# EAGLE schematic Bathroom_Board (EAGLE 6.5.0)
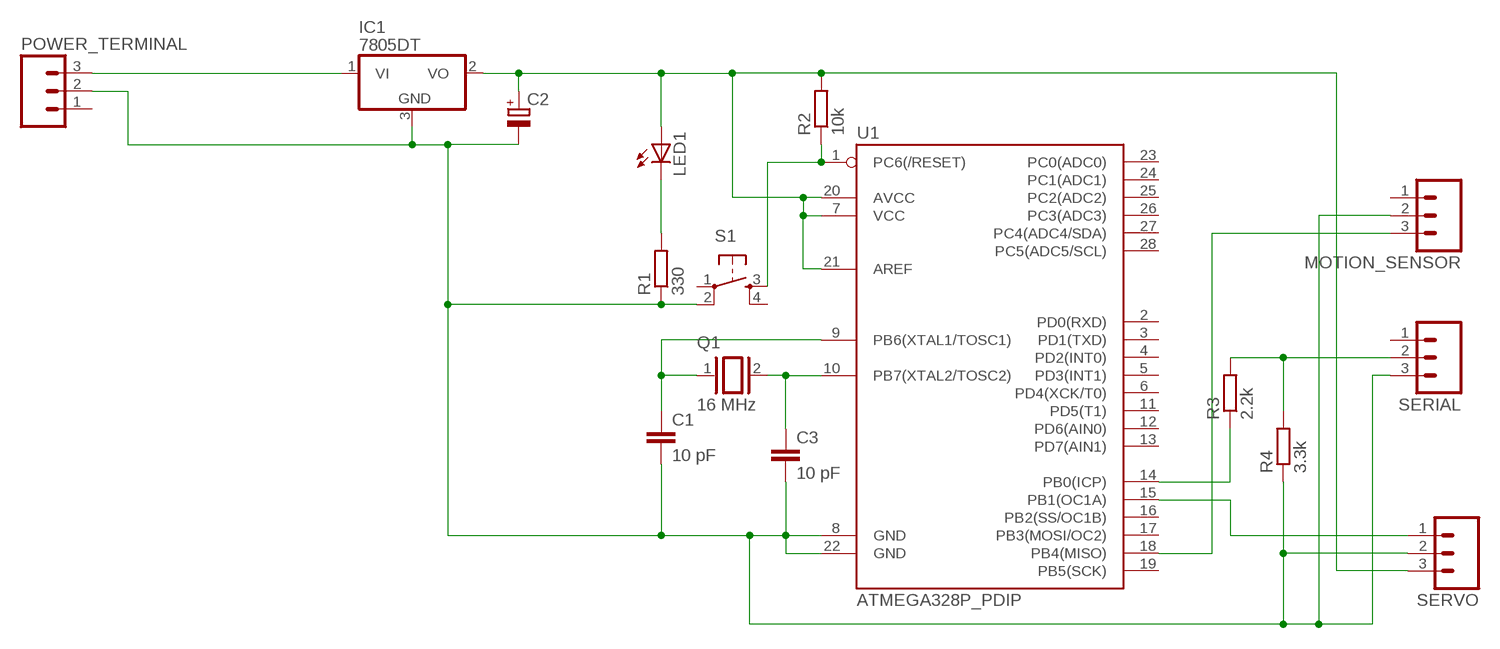
[diagram p0: schematic, sheet 1]

## Parts
C1  10 pF  C-EU025-050X050  [C025-050X050]
C2  CPOL-EU153CLV-0505  [153CLV-0505]
C3  10 pF  C-EU025-050X050  [C025-050X050]
IC1  7805DT  [TO252]
LED1  LED5MM  [LED5MM]
MOTION_SENSOR  M03-SCREW-5MM  [SCREWTERMINAL-5MM-3]
POWER_TERMINAL  M03-SCREW-5MM  [SCREWTERMINAL-5MM-3]
Q1  16 MHz  XTAL/S  [QS]
R1  330  R-EU_0411/12  [0411/12]
R2  10k  R-EU_0411/12  [0411/12]
R3  2.2k  R-EU_0411/12  [0411/12]
R4  3.3k  R-EU_0411/12  [0411/12]
S1  TAC_SWITCHPTH  [TACTILE-PTH]
SERIAL  M03LOCK  [1X03_LOCK]
SERVO  M03LOCK  [1X03_LOCK]
U1  ATMEGA328P_PDIP  [DIL28-3]

## Nets
N$1: IC1.1(VI) POWER_TERMINAL.3
N$2: C1.2 C2.- C3.2 IC1.3(GND) MOTION_SENSOR.2 POWER_TERMINAL.2 R1.1 R4.1 S1.2 SERIAL.3 SERVO.2 U1.8(GND) U1.22(GND)
N$4: C3.1 Q1.2 U1.10(PB7(XTAL2/TOSC2))
N$5: C1.1 Q1.1 U1.9(PB6(XTAL1/TOSC1))
N$6: LED1.K(C) R1.2
N$7: SERVO.1 U1.15(PB1(OC1A))
N$8: R3.1 U1.14(PB0(ICP))
N$9: R3.2 R4.2 SERIAL.2
N$10: R2.1 S1.3 U1.1(PC6(/RESET))
N$12: C2.+ IC1.2(VO) LED1.A R2.2 SERVO.3 U1.7(VCC) U1.20(AVCC) U1.21(AREF)
N$13: MOTION_SENSOR.3 U1.18(PB4(MISO))
Unconnected: MOTION_SENSOR.1 POWER_TERMINAL.1 S1.1 S1.4 SERIAL.1 U1.2(PD0(RXD)) U1.3(PD1(TXD)) U1.4(PD2(INT0)) U1.5(PD3(INT1)) U1.6(PD4(XCK/T0)) U1.11(PD5(T1)) U1.12(PD6(AIN0)) U1.13(PD7(AIN1)) U1.16(PB2(SS/OC1B)) U1.17(PB3(MOSI/OC2)) U1.19(PB5(SCK)) U1.23(PC0(ADC0)) U1.24(PC1(ADC1)) U1.25(PC2(ADC2)) U1.26(PC3(ADC3)) U1.27(PC4(ADC4/SDA)) U1.28(PC5(ADC5/SCL))

## Library data of the parts
C1 C3 = rcl:C-EU: CAPACITOR, European symbol
C2 = rcl:CPOL-EU: POLARIZED CAPACITOR, European symbol
IC1 = linear:78*: Positive VOLTAGE REGULATOR Source: http://cache.national.com/ds/LM/LM78L05.pdf http://www.fairchildsemi.com/ds/LM/LM7805.pdf
LED1 = led:LED: LED OSRAM: - CHIPLED LG R971, LG N971, LY N971, LG Q971, LY Q971, LO R971, LY R971 LH N974, LH R974 LS Q976, LO Q976, LY Q976 LO Q996 - Hyper CHIPLED LW Q18S LB Q993, LB Q99A, LB R99A - SideLED LS A670, LO A670, LY A670, LG A670, LP A670 LB A673, LV A673, LT A673, LW A673 LH A674 LY A675 LS A676, LA A676, LO A676, LY A676, LW A676 LS A679, LY A679, LG A679 - Hyper Micro SIDELED® LS Y876, LA Y876, LO Y876, LY Y876 LT Y87S - SmartLED LW L88C, LW L88S LB L89C, LB L89S, LG L890 LS L89K, LO L89K, LY L89K LS L896, LA L896, LO L896, LY L896 - TOPLED LS T670, LO T670, LY T670, LG T670, LP T670 LSG T670, LSP T670, LSY T670, LOP T670, LYG T670 LG T671, LOG T671, LSG T671 LB T673, LV T673, LT T673, LW T673 LH T674 LS T676, LA T676, LO T676, LY T676, LB T676, LH T676, LSB T676, LW T676 LB T67C, LV T67C, LT T67C, LS T67K, LO T67K, LY T67K, LW E67C LS E67B, LA E67B, LO E67B, LY E67B, LB E67C, LV E67C, LT E67C LW T67C LS T679, LY T679, LG T679 LS T770, LO T770, LY T770, LG T770, LP T770 LB T773, LV T773, LT T773, LW T773 LH T774 LS E675, LA E675, LY E675, LS T675 LS T776, LA T776, LO T776, LY T776, LB T776 LHGB T686 LT T68C, LB T68C - Hyper Mini TOPLED® LB M676 - Mini TOPLED Santana® LG M470 LS M47K, LO M47K, LY M47K Source: http://www.osram.convergy.de LUXEON: - LUMILED® LXK2-PW12-R00, LXK2-PW12-S00, LXK2-PW14-U00, LXK2-PW14-V00 LXK2-PM12-R00, LXK2-PM12-S00, LXK2-PM14-U00 LXK2-PE12-Q00, LXK2-PE12-R00, LXK2-PE12-S00, LXK2-PE14-T00, LXK2-PE14-U00 LXK2-PB12-K00, LXK2-PB12-L00, LXK2-PB12-M00, LXK2-PB14-N00, LXK2-PB14-P00, LXK2-PB14-Q00 LXK2-PR12-L00, LXK2-PR12-M00, LXK2-PR14-Q00, LXK2-PR14-R00 LXK2-PD12-Q00, LXK2-PD12-R00, LXK2-PD12-S00 LXK2-PH12-R00, LXK2-PH12-S00 LXK2-PL12-P00, LXK2-PL12-Q00, LXK2-PL12-R00 Source: www.luxeon.com KINGBRIGHT: KA-3528ASYC Source: www.kingbright.com
MOTION_SENSOR POWER_TERMINAL SERIAL SERVO = SparkFun-Connectors:M03: Header 3 Standard 3-pin 0.1" header. Use with straight break away headers (SKU : PRT-00116), right angle break away headers (PRT-00553), swiss pins (PRT-00743), machine pins (PRT-00117), and female headers (PRT-00115). Molex polarized connector foot print use with SKU : PRT-08232 with associated crimp pins and housings.
Q1 = special:XTAL/S: CRYSTAL
R1-R4 = rcl:R-EU_: RESISTOR, European symbol
S1 = SparkFun-Electromechanical:TAC_SWITCH: Momentary Switch Button commonly used for reset or general input. Spark Fun Electronics SKU : COM-00097 SMT- SWCH-08247
U1 = SparkFun-DigitalIC:ATMEGA328P_PDIP: uC used in the Arduino 32kb flash, 1k EEPROM, 2k SRAM This is the through-hole version of this chip.